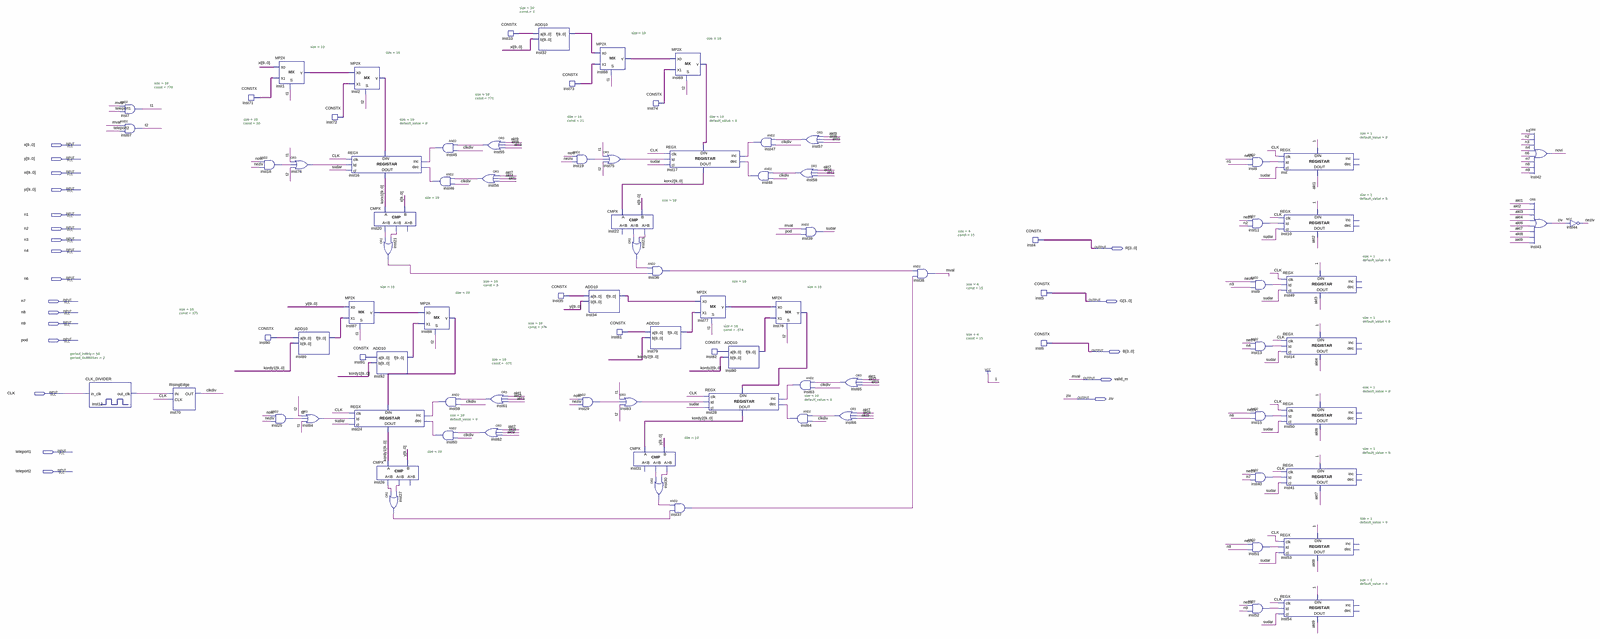
[diagram p0: schematic sheet, whole]
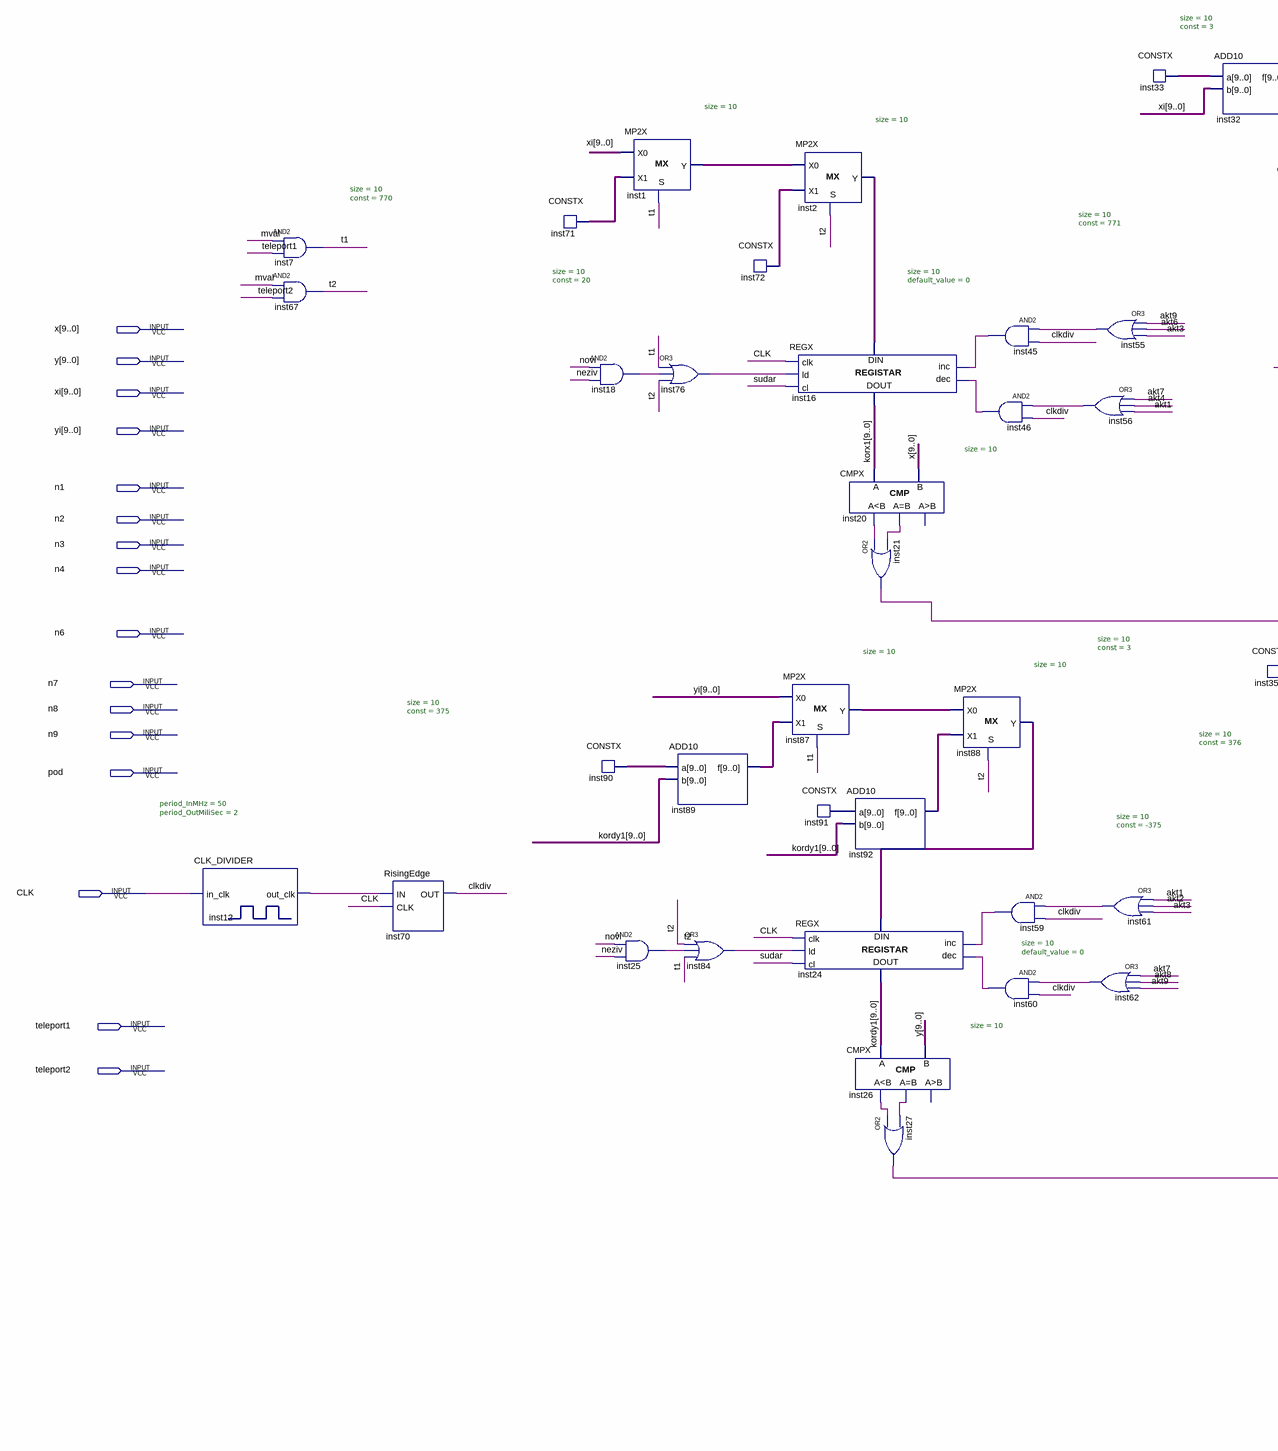
[diagram p1: schematic sheet, left part]
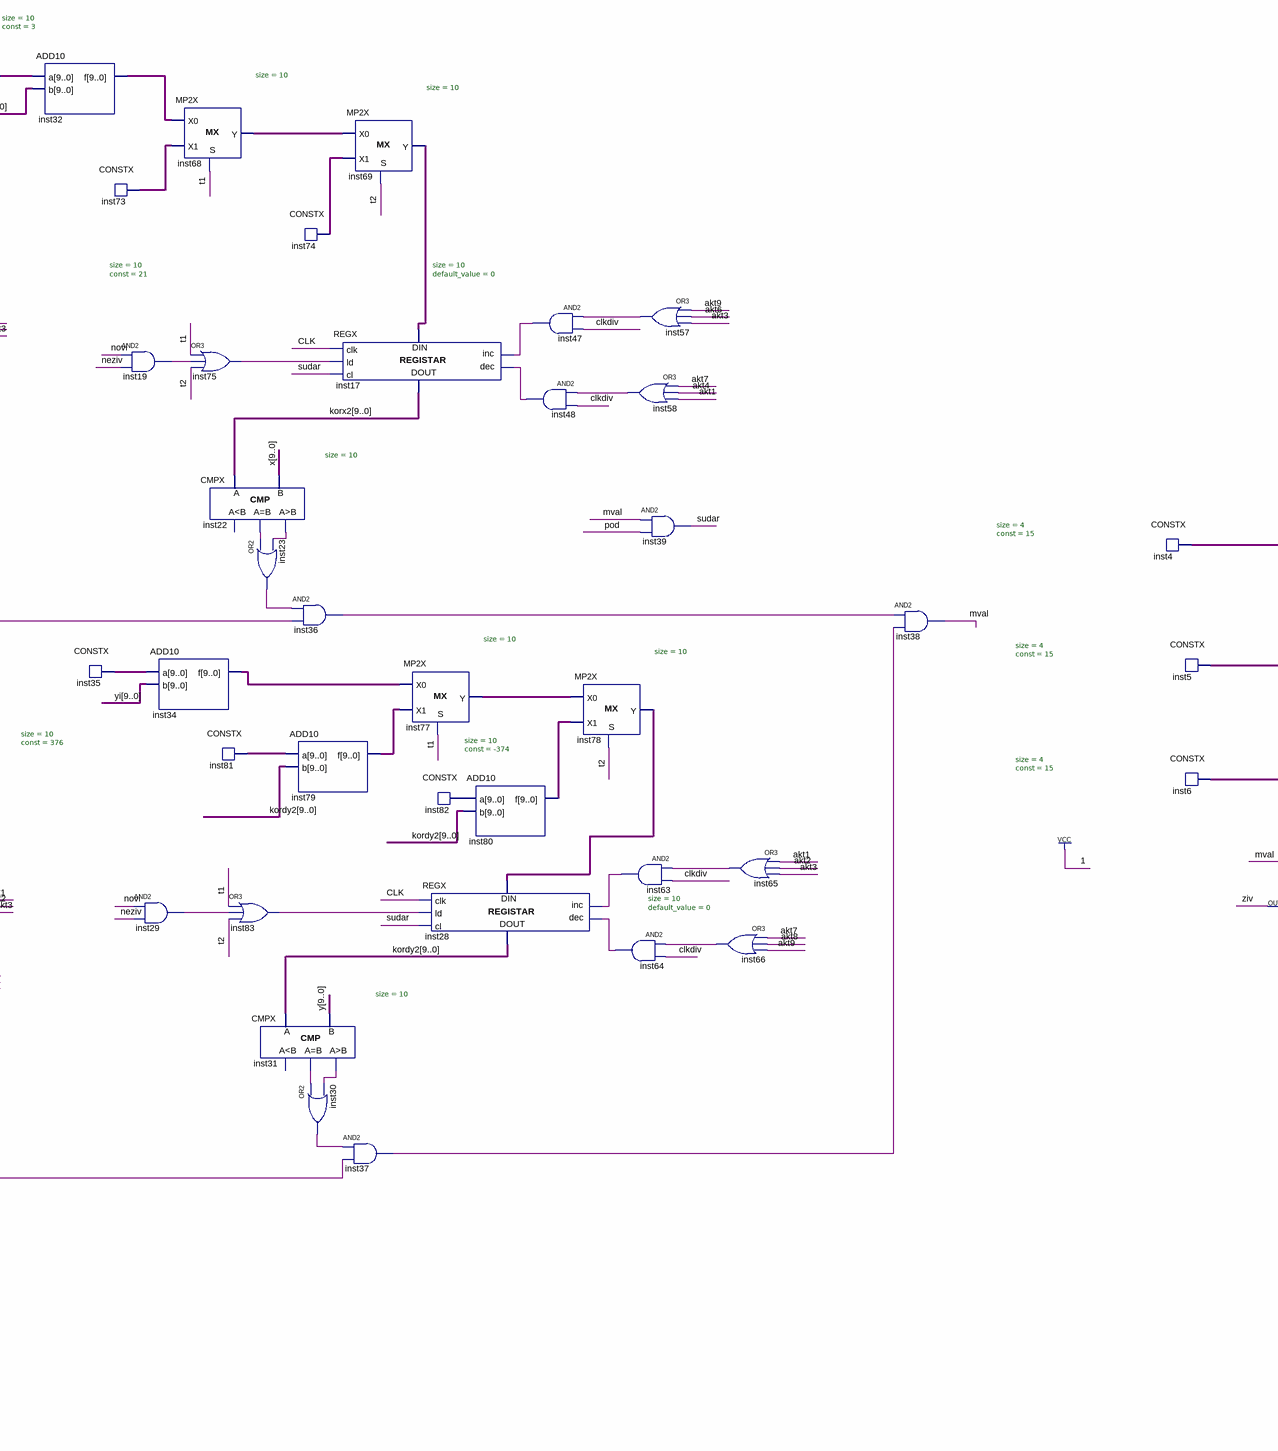
[diagram p2: schematic sheet, centre part]
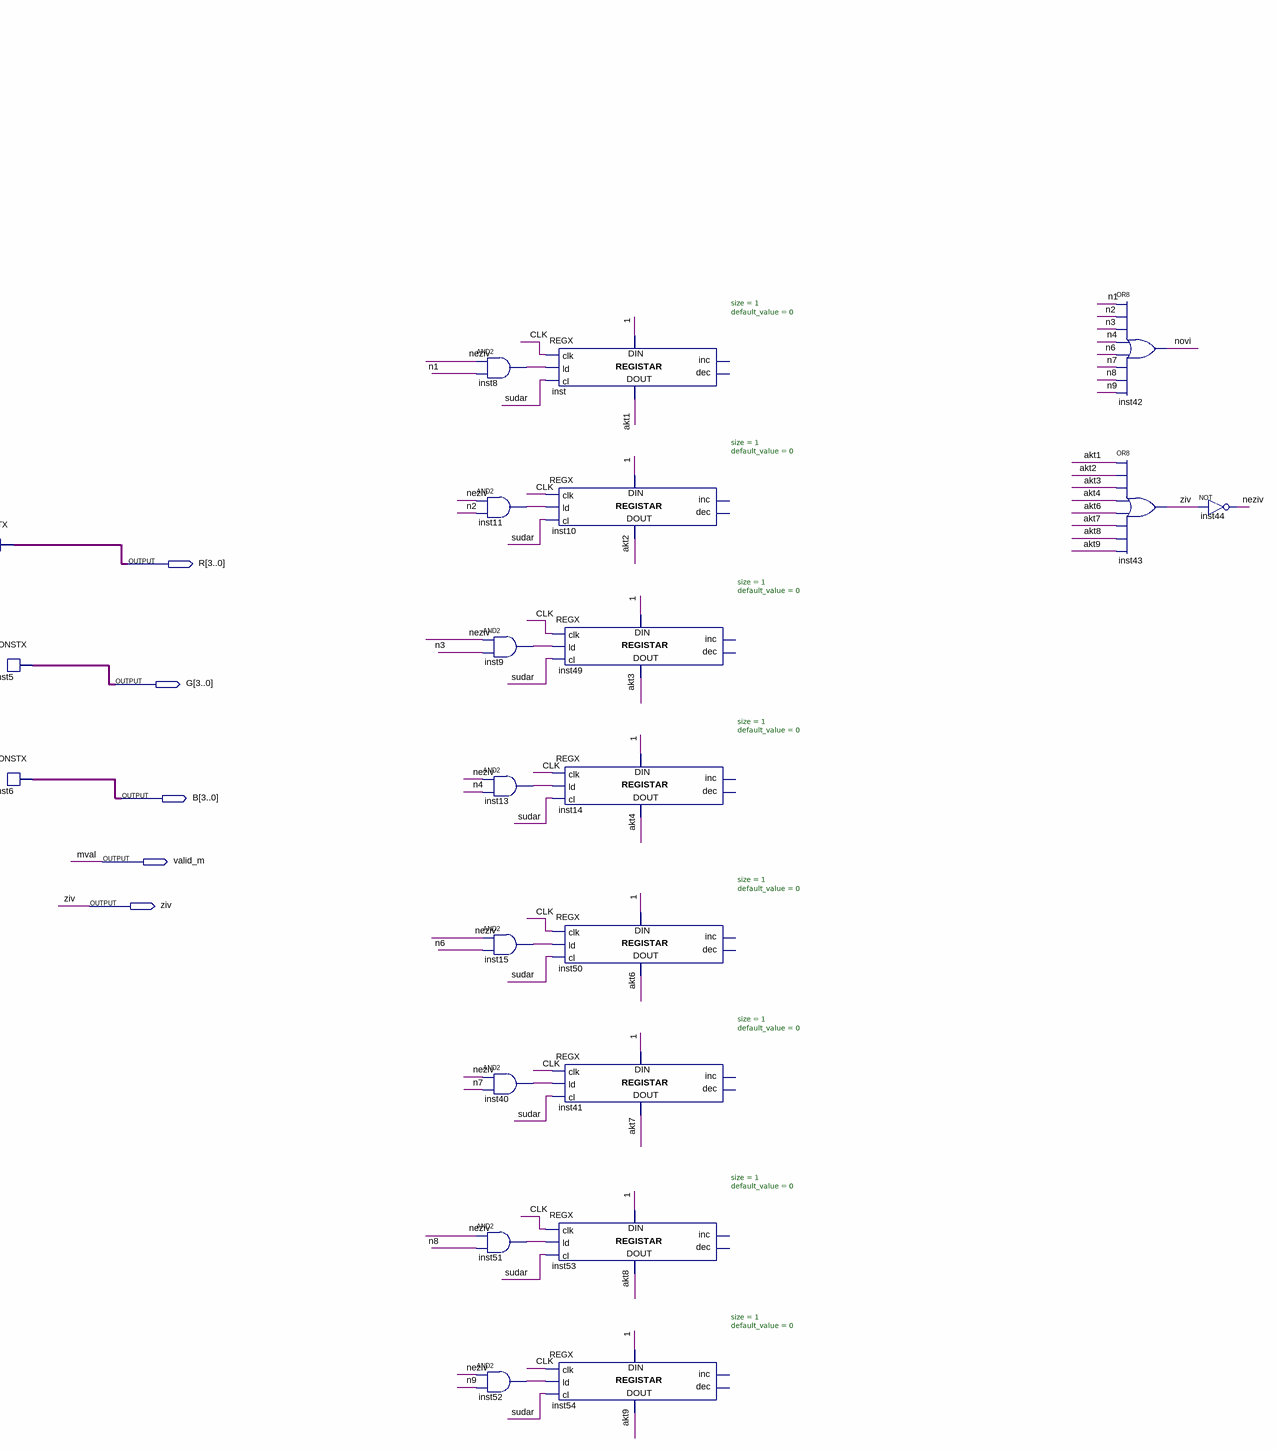
[diagram p3: schematic sheet, right part]
// Quartus schematic Metak.bdf as structural Verilog: 90 symbols, 21 pins
module Metak (
  input  [9:0] x,
  input  [9:0] y,
  input  [9:0] xi,
  input  [9:0] yi,
  input  n1,
  input  n2,
  input  n3,
  input  n4,
  input  n6,
  input  n7,
  input  n8,
  input  n9,
  input  pod,
  input  CLK,
  input  teleport1,
  input  teleport2,
  output [3:0] R,
  output [3:0] G,
  output [3:0] B,
  output valid_m,
  output ziv
);

  wire akt1, akt2, akt3, akt4, akt6, akt7, akt8, akt9, clkdiv, inst8_out, inst9_out, inst11_out,
       inst12_out_clk, inst13_out, inst15_out, inst18_out, inst19_out, inst20_eq, inst20_ls, inst21_out,
       inst22_eq, inst22_gr, inst23_out, inst25_out, inst26_eq, inst26_ls, inst27_out, inst29_out,
       inst30_out, inst31_eq, inst31_gr, inst36_out, inst37_out, inst40_out, inst45_out, inst46_out,
       inst47_out, inst48_out, inst51_out, inst52_out, inst55_out, inst56_out, inst57_out, inst58_out,
       inst59_out, inst60_out, inst61_out, inst62_out, inst63_out, inst64_out, inst65_out, inst66_out,
       inst75_out, inst76_out, inst83_out, inst84_out, neziv, novi, sudar, t1, t2;
  wire [9:0] inst1_y, inst2_y, inst32_f, inst33_data, inst34_f, inst35_data, inst68_y, inst69_y, inst71_data,
       inst72_data, inst73_data, inst74_data, inst77_y, inst78_y, inst79_f, inst80_f, inst81_data,
       inst82_data, inst87_y, inst88_y, inst89_f, inst90_data, inst91_data, inst92_f, kordy1, kordy2, korx1,
       korx2;

  CLK_DIVIDER #(.period_InMHz(50), .period_OutMiliSec(2)) inst12 (.in_clk(CLK), .out_clk(inst12_out_clk));
  and inst7 (t1, valid_m, teleport1);
  and inst67 (t2, valid_m, teleport2);
  RisingEdge inst70 (.IN(inst12_out_clk), .CLK(CLK), .OUT(clkdiv));
  CONSTX #(.size(10), .\const (770)) inst71 (.data(inst71_data));
  and inst18 (inst18_out, novi, neziv);
  CONSTX #(.size(10), .\const (375)) inst90 (.data(inst90_data));
  MP2X #(.size(10)) inst1 (.S(t1), .X0(xi), .X1(inst71_data), .Y(inst1_y));
  and inst25 (inst25_out, novi, neziv);
  or inst76 (inst76_out, t1, inst18_out, t2);
  ADD10 inst89 (.a(inst90_data), .b(kordy1), .f(inst89_f));
  or inst84 (inst84_out, t2, inst25_out, t1);
  CONSTX #(.size(10), .\const (20)) inst72 (.data(inst72_data));
  MP2X #(.size(10)) inst2 (.S(t2), .X0(inst1_y), .X1(inst72_data), .Y(inst2_y));
  REGX #(.size(10), .default_value(0)) inst16 (
    .clk(CLK), .ld(inst76_out), .cl(sudar), .inc(inst45_out), .dec(inst46_out), .data_in(inst2_y),
    .data_out(korx1));
  MP2X #(.size(10)) inst87 (.S(t1), .X0(yi), .X1(inst89_f), .Y(inst87_y));
  CONSTX #(.size(10), .\const (-375)) inst91 (.data(inst91_data));
  REGX #(.size(10), .default_value(0)) inst24 (
    .clk(CLK), .ld(inst84_out), .cl(sudar), .inc(inst59_out), .dec(inst60_out), .data_in(inst88_y),
    .data_out(kordy1));
  CMPX #(.size(10)) inst20 (.A(korx1), .B(x), .ls(inst20_ls), .eq(inst20_eq));  // open: gr
  ADD10 inst92 (.a(inst91_data), .b(kordy1), .f(inst92_f));
  CMPX #(.size(10)) inst26 (.A(kordy1), .B(y), .ls(inst26_ls), .eq(inst26_eq));  // open: gr
  or inst21 (inst21_out, inst20_ls, inst20_eq);
  or inst27 (inst27_out, inst26_ls, inst26_eq);
  MP2X #(.size(10)) inst88 (.S(t2), .X0(inst87_y), .X1(inst92_f), .Y(inst88_y));
  and inst45 (inst45_out, inst55_out, clkdiv);
  and inst46 (inst46_out, inst56_out, clkdiv);
  and inst59 (inst59_out, inst61_out, clkdiv);
  and inst60 (inst60_out, inst62_out, clkdiv);
  or inst55 (inst55_out, akt9, akt6, akt3);
  or inst56 (inst56_out, akt7, akt4, akt1);
  or inst61 (inst61_out, akt1, akt2, akt3);
  or inst62 (inst62_out, akt7, akt8, akt9);
  CONSTX #(.size(10), .\const (3)) inst33 (.data(inst33_data));
  ADD10 inst32 (.a(inst33_data), .b(xi), .f(inst32_f));
  CONSTX #(.size(10), .\const (3)) inst35 (.data(inst35_data));
  CONSTX #(.size(10), .\const (771)) inst73 (.data(inst73_data));
  and inst19 (inst19_out, novi, neziv);
  MP2X #(.size(10)) inst68 (.S(t1), .X0(inst32_f), .X1(inst73_data), .Y(inst68_y));
  ADD10 inst34 (.a(inst35_data), .b(yi), .f(inst34_f));
  and inst29 (inst29_out, novi, neziv);
  or inst75 (inst75_out, t1, inst19_out, t2);
  CMPX #(.size(10)) inst22 (.A(korx2), .B(x), .eq(inst22_eq), .gr(inst22_gr));  // open: ls
  CONSTX #(.size(10), .\const (376)) inst81 (.data(inst81_data));
  or inst83 (inst83_out, t1, inst29_out, t2);
  or inst23 (inst23_out, inst22_eq, inst22_gr);
  CMPX #(.size(10)) inst31 (.A(kordy2), .B(y), .eq(inst31_eq), .gr(inst31_gr));  // open: ls
  CONSTX #(.size(10), .\const (21)) inst74 (.data(inst74_data));
  REGX #(.size(10), .default_value(0)) inst17 (
    .clk(CLK), .ld(inst75_out), .cl(sudar), .inc(inst47_out), .dec(inst48_out), .data_in(inst69_y),
    .data_out(korx2));
  and inst36 (inst36_out, inst23_out, inst21_out);
  ADD10 inst79 (.a(inst81_data), .b(kordy2), .f(inst79_f));
  or inst30 (inst30_out, inst31_eq, inst31_gr);
  MP2X #(.size(10)) inst69 (.S(t2), .X0(inst68_y), .X1(inst74_data), .Y(inst69_y));
  and inst37 (inst37_out, inst30_out, inst27_out);
  MP2X #(.size(10)) inst77 (.S(t1), .X0(inst34_f), .X1(inst79_f), .Y(inst77_y));
  CONSTX #(.size(10), .\const (-374)) inst82 (.data(inst82_data));
  REGX #(.size(10), .default_value(0)) inst28 (
    .clk(CLK), .ld(inst83_out), .cl(sudar), .inc(inst63_out), .dec(inst64_out), .data_in(inst78_y),
    .data_out(kordy2));
  ADD10 inst80 (.a(inst82_data), .b(kordy2), .f(inst80_f));
  and inst47 (inst47_out, inst57_out, clkdiv);
  and inst48 (inst48_out, inst58_out, clkdiv);
  MP2X #(.size(10)) inst78 (.S(t2), .X0(inst77_y), .X1(inst80_f), .Y(inst78_y));
  or inst58 (inst58_out, akt7, akt4, akt1);
  and inst63 (inst63_out, inst65_out, clkdiv);
  and inst64 (inst64_out, inst66_out, clkdiv);
  or inst57 (inst57_out, akt9, akt6, akt3);
  and inst39 (sudar, valid_m, pod);
  or inst65 (inst65_out, akt1, akt2, akt3);
  or inst66 (inst66_out, akt7, akt8, akt9);
  and inst38 (valid_m, inst36_out, inst37_out);
  CONSTX #(.size(4), .\const (15)) inst4 (.data(R));
  CONSTX #(.size(4), .\const (15)) inst5 (.data(G));
  CONSTX #(.size(4), .\const (15)) inst6 (.data(B));
  and inst8 (inst8_out, neziv, n1);
  and inst11 (inst11_out, neziv, n2);
  and inst9 (inst9_out, neziv, n3);
  and inst13 (inst13_out, neziv, n4);
  and inst15 (inst15_out, neziv, n6);
  and inst40 (inst40_out, neziv, n7);
  and inst51 (inst51_out, neziv, n8);
  and inst52 (inst52_out, neziv, n9);
  REGX #(.size(1), .default_value(0)) inst (
    .clk(CLK), .ld(inst8_out), .cl(sudar), .data_in(1'b1), .data_out(akt1));  // open: inc, dec
  REGX #(.size(1), .default_value(0)) inst10 (
    .clk(CLK), .ld(inst11_out), .cl(sudar), .data_in(1'b1), .data_out(akt2));  // open: inc, dec
  REGX #(.size(1), .default_value(0)) inst49 (
    .clk(CLK), .ld(inst9_out), .cl(sudar), .data_in(1'b1), .data_out(akt3));  // open: inc, dec
  REGX #(.size(1), .default_value(0)) inst14 (
    .clk(CLK), .ld(inst13_out), .cl(sudar), .data_in(1'b1), .data_out(akt4));  // open: inc, dec
  REGX #(.size(1), .default_value(0)) inst50 (
    .clk(CLK), .ld(inst15_out), .cl(sudar), .data_in(1'b1), .data_out(akt6));  // open: inc, dec
  REGX #(.size(1), .default_value(0)) inst41 (
    .clk(CLK), .ld(inst40_out), .cl(sudar), .data_in(1'b1), .data_out(akt7));  // open: inc, dec
  REGX #(.size(1), .default_value(0)) inst53 (
    .clk(CLK), .ld(inst51_out), .cl(sudar), .data_in(1'b1), .data_out(akt8));  // open: inc, dec
  REGX #(.size(1), .default_value(0)) inst54 (
    .clk(CLK), .ld(inst52_out), .cl(sudar), .data_in(1'b1), .data_out(akt9));  // open: inc, dec
  or inst42 (novi, n1, n2, n3, n4, n6, n7, n8, n9);
  or inst43 (ziv, akt1, akt2, akt3, akt4, akt6, akt7, akt8, akt9);
  not inst44 (neziv, ziv);

  // Other names for the same wires on the sheet: mval = valid_m
endmodule
